# EAGLE design board (EAGLE 9.1.0)
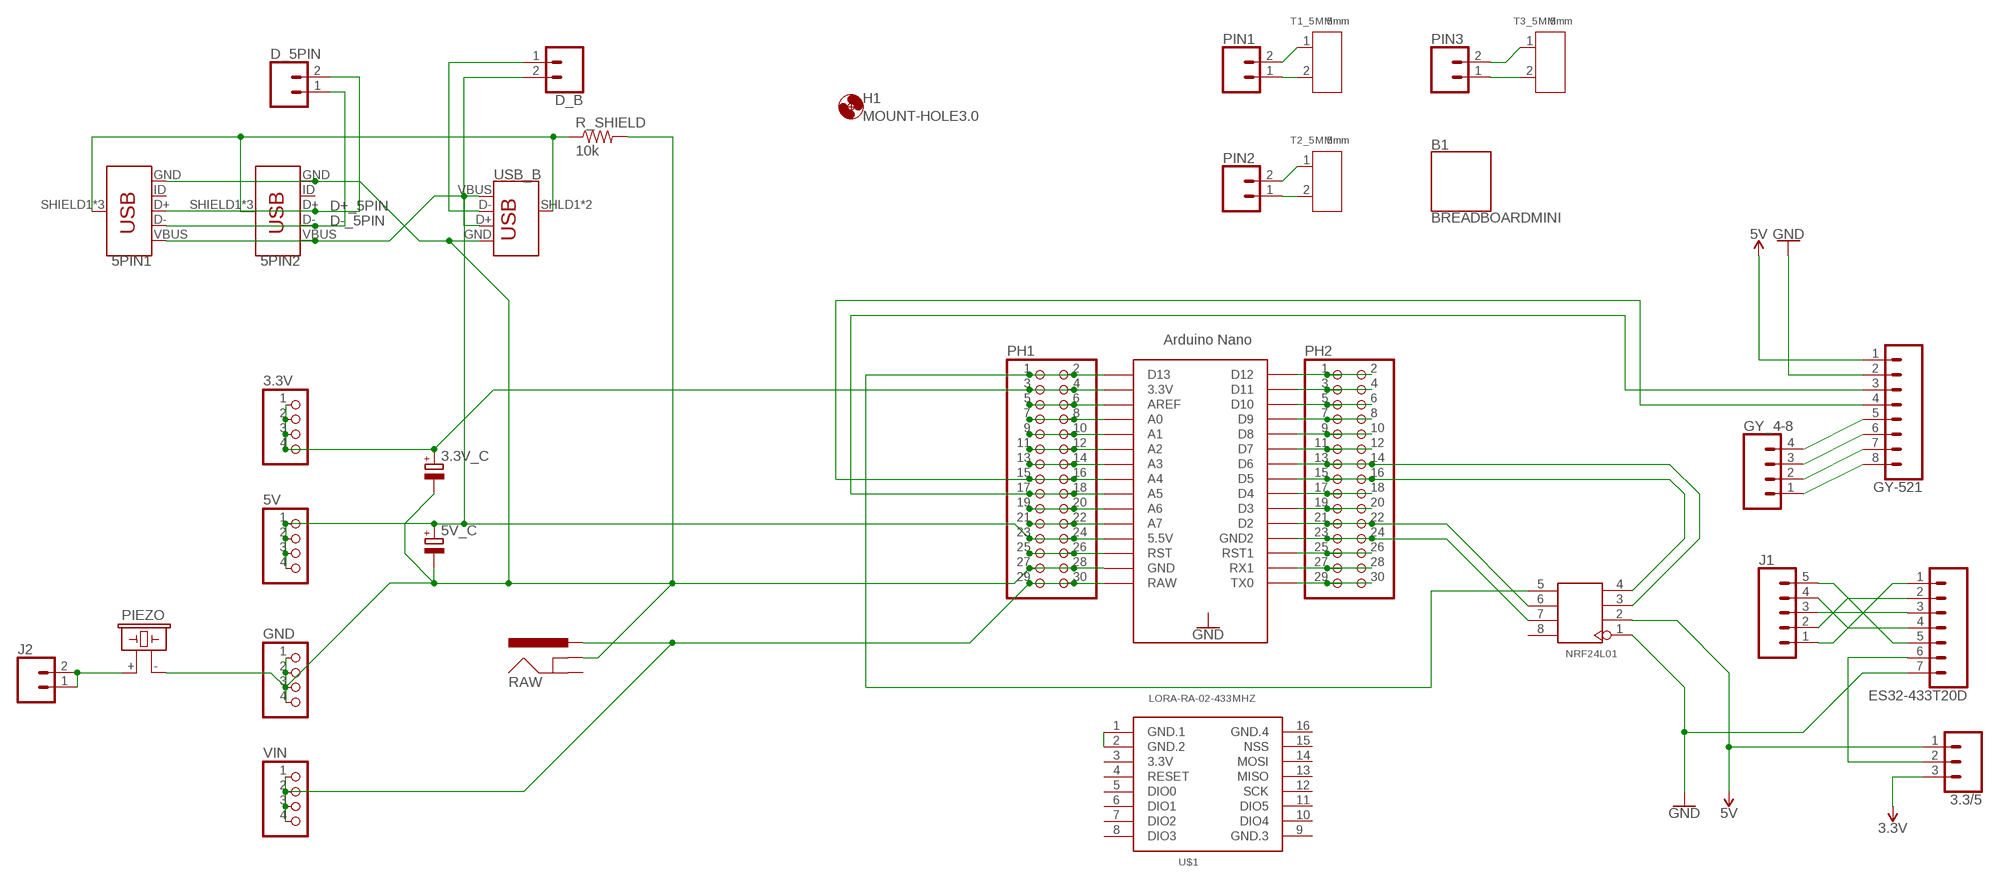
[diagram p0: schematic, sheet 1]

## Parts
3.3/5  CONN_03LOCK  [1X03_LOCK]
3.3V  PINHD-1X4  [1X04]
3.3V_C  CPOL-EUE2.5-5  [E2,5-5]
5PIN1  USB_MICRO-B_FEMALE-SMT  [USB-B-MICRO-SMD]
5PIN2  USB_MICRO-B_FEMALE-SMT  [USB-B-MICRO-SMD]
5V  PINHD-1X4  [1X04]
5V_C  CPOL-EUE3.5-8  [E3,5-8]
B1  BREADBOARDMINI  [BREADBOARD-MINI]
D_5PIN  CONN_02LOCK  [1X02_LOCK]
D_B  CONN_02LOCK  [1X02_LOCK]
ES32-433T20D  CONN_07LOCK  [1X07_LOCK]
GND  PINHD-1X4  [1X04]
GY-521  CONN_08LOCK  [1X08_LOCK]
GY_4-8  CONN_04LOCK  [1X04_LOCK]
H1  MOUNT-HOLE3.0  [3,0]
J1  CONN_05LOCK  [1X05_LOCK]
J2  CONN_02LOCK  [1X02_LOCK]
NANO  NANO  [NANO]
NRF24L01  DIP-BLACK-FEMALE-HEADER(2X4P-2.54)  [H2X4-2.54]
PH1  PINHD-2X15  [2X15]
PH2  PINHD-2X15  [2X15]
PIEZO  F/CM12P  [F/CM12P]
PIN1  CONN_02LOCK  [1X02_LOCK]
PIN2  CONN_02LOCK  [1X02_LOCK]
PIN3  CONN_02LOCK  [1X02_LOCK]
R_SHIELD  10k  R-US_0207/7  [0207/7]
RAW  POWER_JACKSLT  [POWER_JACK_SLOT]
T1_5MM  5mm  SCREW-TERMINAL-GREEN(2P-5.0)  [H2-5.0-10.5X8.0MM]
T2_5MM  5mm  SCREW-TERMINAL-GREEN(2P-5.0)  [H2-5.0-10.5X8.0MM]
T3_5MM  5mm  SCREW-TERMINAL-GREEN(2P-5.0)  [H2-5.0-10.5X8.0MM]
U$1  LORA-RA-02-433MHZ  [LORA-RA2-SMD]
USB_B  USB_B_PTH  [USB-B-PTH]
VIN  PINHD-1X4  [1X04]

## Nets
3.3V [power]: 3.3/5.3 3.3V.1 3.3V.2 3.3V.3 3.3V.4 3.3V_C.+ NANO.3.3V PH1.3 PH1.4
5V [power]: 3.3/5.1 5PIN1.VBUS 5PIN2.VBUS 5V.1 5V.2 5V.3 5V.4 5V_C.+ GY-521.1 NANO.5V(5.5V) NRF24L01.2 PH1.23 PH1.24 USB_B.VBUS
A5: GY-521.3 NANO.A5 PH1.17 PH1.18
A6: NANO.A6 PH1.19 PH1.20
A7: NANO.A7 PH1.21 PH1.22
CE_NRF: NANO.D6 NRF24L01.3 PH2.13 PH2.14
CSN_NRF: NANO.D5 NRF24L01.4 PH2.15 PH2.16
D+_5PIN: 5PIN1.D+ 5PIN2.D+ D_5PIN.2
D-_5PIN: 5PIN1.D- 5PIN2.D- D_5PIN.1
GND [power]: 3.3V_C.- 5PIN1.GND 5PIN2.GND 5V_C.- ES32-433T20D.7 GND.1 GND.2 GND.3 GND.4 GY-521.2 NANO.GND NANO.ICSP6 NRF24L01.1 PH1.27 PH1.28 PIEZO.- R_SHIELD.2 RAW.GND@1(GNDBREAK) USB_B.GND
MISO_NRF: NANO.GND1(GND2) NRF24L01.7 PH2.23 PH2.24
MOSI_NRF: NANO.D2 NRF24L01.6 PH2.21 PH2.22
N$1: U$1.1(GND.1) U$1.2(GND.2)
N$2: GY-521.5 GY_4-8.4
N$3: NANO.AREF PH1.5 PH1.6
N$4: NANO.A0 PH1.7 PH1.8
N$5: NANO.A1 PH1.9 PH1.10
N$6: NANO.A2 PH1.11 PH1.12
N$7: NANO.A3 PH1.13 PH1.14
N$8: GY-521.6 GY_4-8.3
N$9: GY-521.7 GY_4-8.2
N$10: GY-521.8 GY_4-8.1
N$11: 3.3/5.2 ES32-433T20D.6
N$12: ES32-433T20D.1 J1.1
N$13: ES32-433T20D.4 J1.4
N$14: ES32-433T20D.3 J1.3
N$15: ES32-433T20D.2 J1.2
N$16: NANO.D12 PH2.1 PH2.2
N$17: NANO.D11 PH2.3 PH2.4
N$18: NANO.D10 PH2.5 PH2.6
N$19: NANO.D9 PH2.7 PH2.8
N$20: NANO.D8 PH2.9 PH2.10
N$21: NANO.D7 PH2.11 PH2.12
N$22: ES32-433T20D.5 J1.5
N$23 [terminal]: PIN1.2 T1_5MM.1
N$24: NANO.D4 PH2.17 PH2.18
N$25: NANO.D3 PH2.19 PH2.20
N$26 [terminal]: PIN1.1 T1_5MM.2
N$27 [terminal]: PIN2.2 T2_5MM.1
N$28: NANO.RST1 PH2.25 PH2.26
N$29: NANO.RX1 PH2.27 PH2.28
N$30: NANO.TX0 PH2.29 PH2.30
N$31 [terminal]: PIN2.1 T2_5MM.2
N$32 [terminal]: PIN3.2 T3_5MM.1
N$33 [terminal]: PIN3.1 T3_5MM.2
N$34: J2.1 J2.2 PIEZO.+
N$35: D_B.1 USB_B.D-
N$36: D_B.2 USB_B.D+
RST: NANO.RST PH1.25 PH1.26
SCK_NRF: NANO.D13 NRF24L01.5 PH1.1 PH1.2
SDA_GY521: GY-521.4 NANO.A4 PH1.15 PH1.16
SHIELD_IN [power]: 5PIN1.SHIELD1(SHIELD) 5PIN1.SHIELD2(SHIELD) 5PIN1.SHIELD3(SHIELD) 5PIN2.SHIELD1(SHIELD) 5PIN2.SHIELD2(SHIELD) 5PIN2.SHIELD3(SHIELD) R_SHIELD.1 USB_B.SHLD1(SHIELD) USB_B.SHLD2(SHIELD)
VIN [power]: NANO.RAW PH1.29 PH1.30 RAW.PWR VIN.1 VIN.2 VIN.3 VIN.4
Unconnected: 5PIN1.ID 5PIN2.ID NANO.ICSP1 NANO.ICSP2 NANO.ICSP3 NANO.ICSP4 NANO.ICSP5 NRF24L01.8 RAW.GND@2(GND) U$1.4(RESET) U$1.5(DIO0) U$1.6(DIO1) U$1.7(DIO2) U$1.8(DIO3) U$1.10(DIO4) U$1.11(DIO5) U$1.12(SCK) U$1.13(MISO) U$1.14(MOSI) U$1.15(NSS)

## Power pins joined to a net without a drawn wire
3.3V: U$1.3(3.3V)
GND.3: U$1.9(GND.3)
GND.4: U$1.16(GND.4)

## Library data of the parts
3.3/5 = SparkFun-Connectors:CONN_03: Multi connection point. Often used as Generic Header-pin footprint for 0.1 inch spaced/style header connections On any of the 0.1 inch spaced packages, you can populate with these: Break Away Headers - Straight <https://www.sparkfun.com/products/116> (PRT-00116) Break Away Male Headers - Right Angle <https://www.sparkfun.com/products/553> (PRT-00553) Female Headers <https://www.sparkfun.com/products/115> (PRT-00115) Break Away Headers - Machine Pin <https://www.sparkfun.com/products/117> (PRT-00117) Break Away Female Headers - Swiss Machine Pin <https://www.sparkfun.com/products/743> (PRT-00743) Stackable Header - 3 Pin (Female, 0.1") <https://www.sparkfun.com/products/13875> (PRT-13875) For SCREWTERMINALS and SPRING TERMINALS visit here: Screw Terimnals on SparkFun.com <https://www.sparkfun.com/search/results?term=Screw+Terminals> (5mm/3.5mm/2.54mm spacing) This device is also useful as a general connection point to wire up your design to another part of your project. Our various solder wires solder well into these plated through hole pads. Hook-Up Wire - Assortment (Stranded, 22 AWG) <https://www.sparkfun.com/products/11375> (PRT-11375) Hook-Up Wire - Assortment (Solid Core, 22 AWG) <https://www.sparkfun.com/products/11367> (PRT-11367) View the entire wire category on our website here <https://www.sparkfun.com/categories/141> Special notes: Molex polarized connector foot print use with SKU : PRT-08232 with associated crimp pins and housings.
3.3V 5V GND VIN = pinhead:PINHD-1X4: PIN HEADER
3.3V_C = rcl:CPOL-EU: POLARIZED CAPACITOR, European symbol; SPICEPREFIX: C
5PIN1 5PIN2 = SparkFun-Connectors:USB_MICRO-B: USB Type Micro-B Connector Male/female and PTH/SMT variants SparkFun Products: SparkFun microB USB Breakout <https://www.sparkfun.com/products/12035> SparkFun USB microB Plug Breakout <https://www.sparkfun.com/products/10031> SparkFun ESP8266 Thing <https://www.sparkfun.com/products/13231>; PROD_ID: CONN-11752
5V_C = resistor:CPOL-EU: POLARIZED CAPACITOR, European symbol
B1 = SparkFun-Boards:BREADBOARD: SparkFun Breadboard Mini This is the mechnical outline for the very small self adhesive breadboard from SparkFun Electronics and our prototyping breadboard of the same size. Good for very small proto areas. SparkFun Products: White <https://www.sparkfun.com/products/7916> Green <https://www.sparkfun.com/products/12046> Black <https://www.sparkfun.com/products/12047> Red <https://www.sparkfun.com/products/12044> Blue <https://www.sparkfun.com/products/12045> SparkFun Solder-able Breadboard-Mini <https://www.sparkfun.com/products/12702>; PROD_ID: COMP-12034
D_5PIN D_B J2 PIN1-PIN3 = SparkFun-Connectors:CONN_02: Multi connection point. Often used as Generic Header-pin footprint for 0.1 inch spaced/style header connections On any of the 0.1 inch spaced packages, you can populate with these: Break Away Headers - Straight <https://www.sparkfun.com/products/116> (PRT-00116) Break Away Male Headers - Right Angle <https://www.sparkfun.com/products/553> (PRT-00553) Female Headers <https://www.sparkfun.com/products/115> (PRT-00115) Break Away Headers - Machine Pin <https://www.sparkfun.com/products/117> (PRT-00117) Break Away Female Headers - Swiss Machine Pin <https://www.sparkfun.com/products/743> (PRT-00743) For SCREWTERMINALS and SPRING TERMINALS visit here: Screw Terimnals on SparkFun.com <https://www.sparkfun.com/search/results?term=Screw+Terminals> (5mm/3.5mm/2.54mm spacing) This device is also useful as a general connection point to wire up your design to another part of your project. Our various solder wires solder well into these plated through hole pads. Hook-Up Wire - Assortment (Stranded, 22 AWG) <https://www.sparkfun.com/products/11375> (PRT-11375) Hook-Up Wire - Assortment (Solid Core, 22 AWG) <https://www.sparkfun.com/products/11367> (PRT-11367) View the entire wire category on our website here <https://www.sparkfun.com/categories/141> Special notes: Molex polarized connector foot print use with: PRT-08233 with associated crimp pins and housings. 2.54_SCREWTERM for use with PRT-10571. 3.5mm Screw Terminal footprints for PRT-08084 5mm Screw Terminal footprints for use with PRT-08432
ES32-433T20D = SparkFun-Connectors:CONN_07: Multi connection point. Often used as Generic Header-pin footprint for 0.1 inch spaced/style header connections On any of the 0.1 inch spaced packages, you can populate with these: Break Away Headers - Straight <https://www.sparkfun.com/products/116> (PRT-00116) Break Away Male Headers - Right Angle <https://www.sparkfun.com/products/553> (PRT-00553) Female Headers <https://www.sparkfun.com/products/115> (PRT-00115) Break Away Headers - Machine Pin <https://www.sparkfun.com/products/117> (PRT-00117) Break Away Female Headers - Swiss Machine Pin <https://www.sparkfun.com/products/743> (PRT-00743) For SCREWTERMINALS and SPRING TERMINALS visit here: Screw Terimnals on SparkFun.com <https://www.sparkfun.com/search/results?term=Screw+Terminals> (5mm/3.5mm/2.54mm spacing) This device is also useful as a general connection point to wire up your design to another part of your project. Our various solder wires solder well into these plated through hole pads. Hook-Up Wire - Assortment (Stranded, 22 AWG) <https://www.sparkfun.com/products/11375> (PRT-11375) Hook-Up Wire - Assortment (Solid Core, 22 AWG) <https://www.sparkfun.com/products/11367> (PRT-11367) View the entire wire category on our website here <https://www.sparkfun.com/categories/141> Special notes: Molex polarized connector foot print use with SKU : PRT-08231 with associated crimp pins and housings. 1MM SMD Version SKU: PRT-10208 NOTES ON THE VARIANTS LOCK and LOCK_LONGPADS... This footprint was designed to help hold the alignment of a through-hole component (i.e. 6-pin header) while soldering it into place. You may notice that each hole has been shifted either up or down by 0.005 of an inch from it's more standard position (which is a perfectly straight line). This slight alteration caused the pins (the squares in the middle) to touch the edges of the holes. Because they are alternating, it causes a "brace" to hold the component in place. 0.005 has proven to be the perfect amount of "off-center" position when using our standard breakaway headers. Although looks a little odd when you look at the bare footprint, once you have a header in there, the alteration is very hard to notice. Also,if you push a header all the way into place, it is covered up entirely on the bottom side.
GY-521 = SparkFun-Connectors:CONN_08: Multi connection point. Often used as Generic Header-pin footprint for 0.1 inch spaced/style header connections On any of the 0.1 inch spaced packages, you can populate with these: Break Away Headers - Straight <https://www.sparkfun.com/products/116> (PRT-00116) Break Away Male Headers - Right Angle <https://www.sparkfun.com/products/553> (PRT-00553) Female Headers <https://www.sparkfun.com/products/115> (PRT-00115) Break Away Headers - Machine Pin <https://www.sparkfun.com/products/117> (PRT-00117) Break Away Female Headers - Swiss Machine Pin <https://www.sparkfun.com/products/743> (PRT-00743) Arduino Stackable Header - 8 Pin <https://www.sparkfun.com/products/9279> (PRT-09279) For SCREWTERMINALS and SPRING TERMINALS visit here: Screw Terimnals on SparkFun.com <https://www.sparkfun.com/search/results?term=Screw+Terminals> (5mm/3.5mm/2.54mm spacing) This device is also useful as a general connection point to wire up your design to another part of your project. Our various solder wires solder well into these plated through hole pads. Hook-Up Wire - Assortment (Stranded, 22 AWG) <https://www.sparkfun.com/products/11375> (PRT-11375) Hook-Up Wire - Assortment (Solid Core, 22 AWG) <https://www.sparkfun.com/products/11367> (PRT-11367) View the entire wire category on our website here <https://www.sparkfun.com/categories/141> Special notes: Molex polarized connector foot print use with SKU : PRT-08231 with associated crimp pins and housings. 1MM SMD Version SKU: PRT-10208 NOTES ON THE VARIANTS LOCK and LOCK_LONGPADS... This footprint was designed to help hold the alignment of a through-hole component (i.e. 6-pin header) while soldering it into place. You may notice that each hole has been shifted either up or down by 0.005 of an inch from it's more standard position (which is a perfectly straight line). This slight alteration caused the pins (the squares in the middle) to touch the edges of the holes. Because they are alternating, it causes a "brace" to hold the component in place. 0.005 has proven to be the perfect amount of "off-center" position when using our standard breakaway headers. Although looks a little odd when you look at the bare footprint, once you have a header in there, the alteration is very hard to notice. Also,if you push a header all the way into place, it is covered up entirely on the bottom side.
GY_4-8 = SparkFun-Connectors:CONN_04: Multi connection point. Often used as Generic Header-pin footprint for 0.1 inch spaced/style header connections On any of the 0.1 inch spaced packages, you can populate with these: Break Away Headers - Straight <https://www.sparkfun.com/products/116> (PRT-00116) Break Away Male Headers - Right Angle <https://www.sparkfun.com/products/553> (PRT-00553) Female Headers <https://www.sparkfun.com/products/115> (PRT-00115) Break Away Headers - Machine Pin <https://www.sparkfun.com/products/117> (PRT-00117) Break Away Female Headers - Swiss Machine Pin <https://www.sparkfun.com/products/743> (PRT-00743) For SCREWTERMINALS and SPRING TERMINALS visit here: Screw Terimnals on SparkFun.com <https://www.sparkfun.com/search/results?term=Screw+Terminals> (5mm/3.5mm/2.54mm spacing) This device is also useful as a general connection point to wire up your design to another part of your project. Our various solder wires solder well into these plated through hole pads. Hook-Up Wire - Assortment (Stranded, 22 AWG) <https://www.sparkfun.com/products/11375> (PRT-11375) Hook-Up Wire - Assortment (Solid Core, 22 AWG) <https://www.sparkfun.com/products/11367> (PRT-11367) View the entire wire category on our website here <https://www.sparkfun.com/categories/141> Special notes: Molex polarized connector foot print use with SKU : PRT-08231 with associated crimp pins and housings. 1MM SMD Version SKU: PRT-10208; PROD_ID: CONN-09696
H1 = holes:MOUNT-HOLE: MOUNTING HOLE with drill center marker
J1 = SparkFun-Connectors:CONN_05: Multi connection point. Often used as Generic Header-pin footprint for 0.1 inch spaced/style header connections On any of the 0.1 inch spaced packages, you can populate with these: Break Away Headers - Straight <https://www.sparkfun.com/products/116> (PRT-00116) Break Away Male Headers - Right Angle <https://www.sparkfun.com/products/553> (PRT-00553) Female Headers <https://www.sparkfun.com/products/115> (PRT-00115) Break Away Headers - Machine Pin <https://www.sparkfun.com/products/117> (PRT-00117) Break Away Female Headers - Swiss Machine Pin <https://www.sparkfun.com/products/743> (PRT-00743) For SCREWTERMINALS and SPRING TERMINALS visit here: Screw Terimnals on SparkFun.com <https://www.sparkfun.com/search/results?term=Screw+Terminals> (5mm/3.5mm/2.54mm spacing) This device is also useful as a general connection point to wire up your design to another part of your project. Our various solder wires solder well into these plated through hole pads. Hook-Up Wire - Assortment (Stranded, 22 AWG) <https://www.sparkfun.com/products/11375> (PRT-11375) Hook-Up Wire - Assortment (Solid Core, 22 AWG) <https://www.sparkfun.com/products/11367> (PRT-11367) View the entire wire category on our website here <https://www.sparkfun.com/categories/141> Special notes: Molex polarized connector foot print use with SKU : PRT-08231 with associated crimp pins and housings. 1MM SMD Version SKU: PRT-10208
NANO = Arduino-clone:NANO: Arduino Nano
NRF24L01 = Seeed-Connector:DIP-BLACK-FEMALE-HEADER(2X4P-2.54): 320030087; VALUE: 2X4P-2.54
PH1 PH2 = pinhead:PINHD-2X15: PIN HEADER
PIEZO = buzzer:F/CM12P: BUZZER Source: Buerklin; OC_FARNELL: unknown; OC_NEWARK: unknown
R_SHIELD = rcl:R-US_: RESISTOR, American symbol; SPICEPREFIX: R
RAW = SparkFun-Connectors:POWER_JACK: Power Jack Connector This is the standard 5.5mm barrel jack for power. The PTH is the most common, proven, reliable, footprint. The Slot footprint only works if the mill layer is transmitted to the PCB fab house so be warned. Here are the connectors we sell at SparkFun: DC Barrel Power Jack/Connector <https://www.sparkfun.com/products/119> (PRT-00119) DC Barrel Power Jack/Connector (SMD) <https://www.sparkfun.com/products/12748> (PRT-12748) DC Barrel Jack Adapter - Breadboard Compatible <https://www.sparkfun.com/products/10811> (PRT-10811) It is used on this SparkFun product (and many, many others): SparkFun RedBoard - Programmed with Arduino <https://www.sparkfun.com/products/12757> (DEV-12757) Also, if you need a mating power supply or connector, please check these out: Wall Adapter Power Supply - 9VDC 650mA <https://www.sparkfun.com/products/298> (TOL-00298) DC Barrel Jack Adapter - Male <https://www.sparkfun.com/products/10287> (PRT-10287); PROD_ID: PRT-00119
T1_5MM T2_5MM T3_5MM = Seeed-Connector:SCREW-TERMINAL-GREEN(2P-5.0): 320110031; VALUE: GREEN-2P-5.0
U$1 = LikeCircuit:LORA-RA-02-433MHZ: 433 MHz Lora Ra-02 Radio Transceiver Module based on SX1276 chip. Visit our more eagle PCB <https://www.likecircuit.com/>
USB_B = SparkFun-Connectors:USB_B: USB Type B Connector SparkFun Products: SparkFun Stepoko <https://www.sparkfun.com/products/13899> PTH; PROD_ID: CONN-08278; SF_ID: PRT-00139

## Net classes
0 default: width 0.127 mm, drill 0.127 mm, clearance 0.127 mm
1 power: width 0.762 mm, clearance 0.305 mm
2 terminal: width 2.54 mm, clearance 0.305 mm

## Board
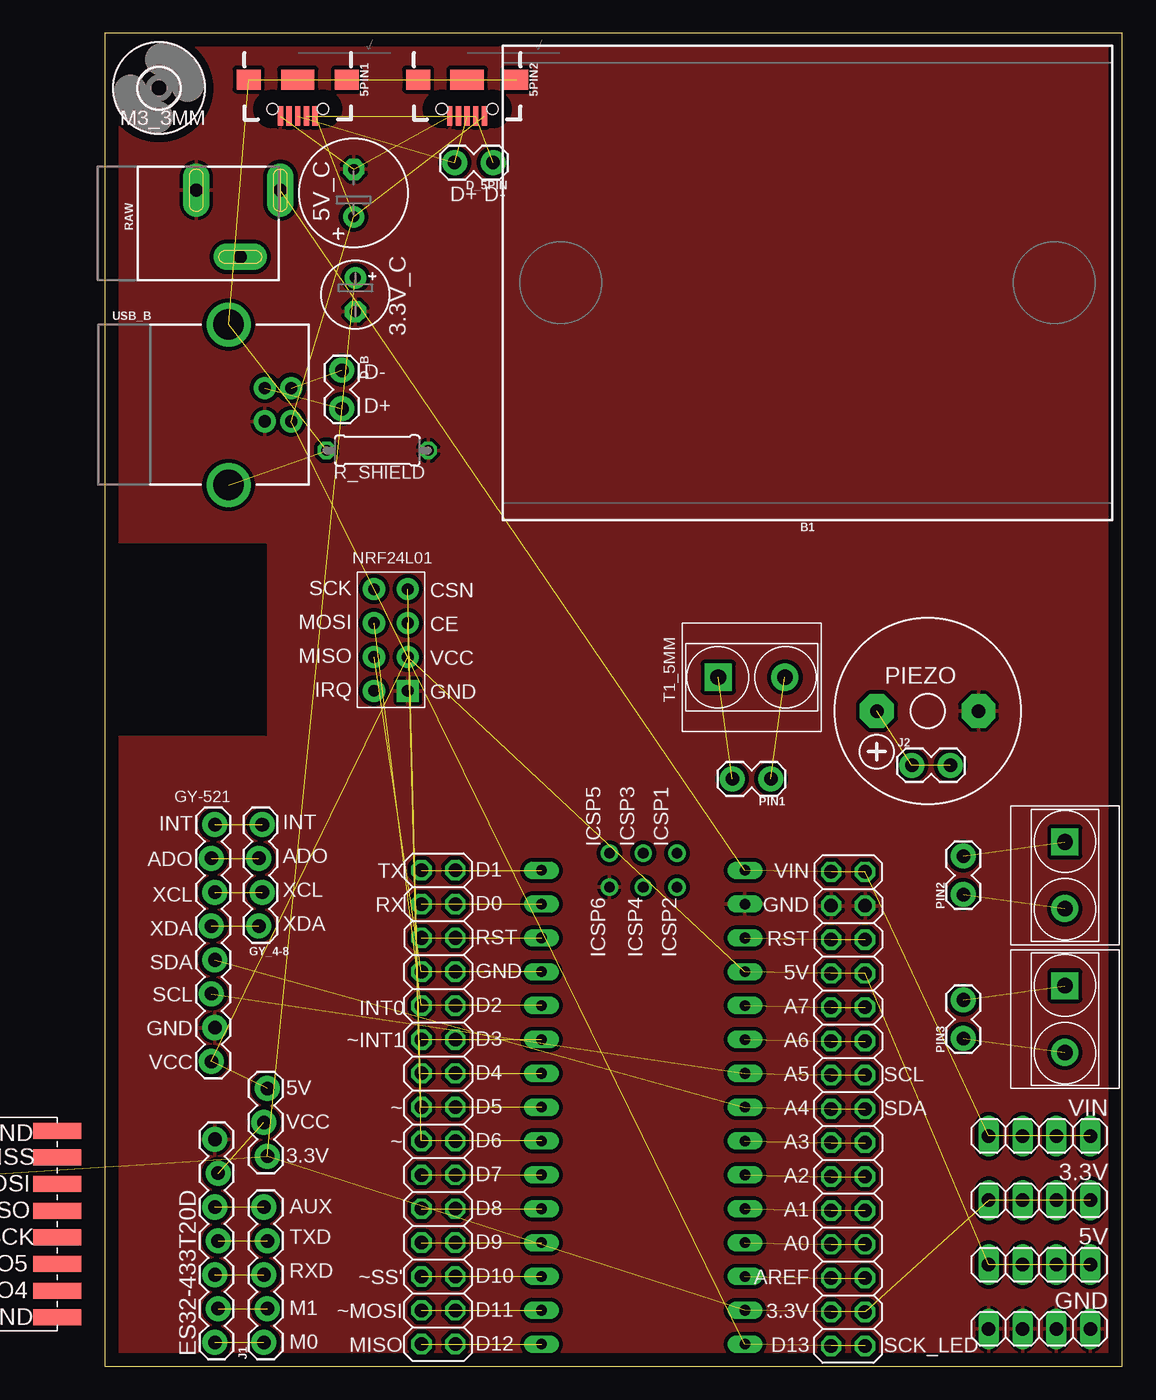
[diagram p1: board, top side]
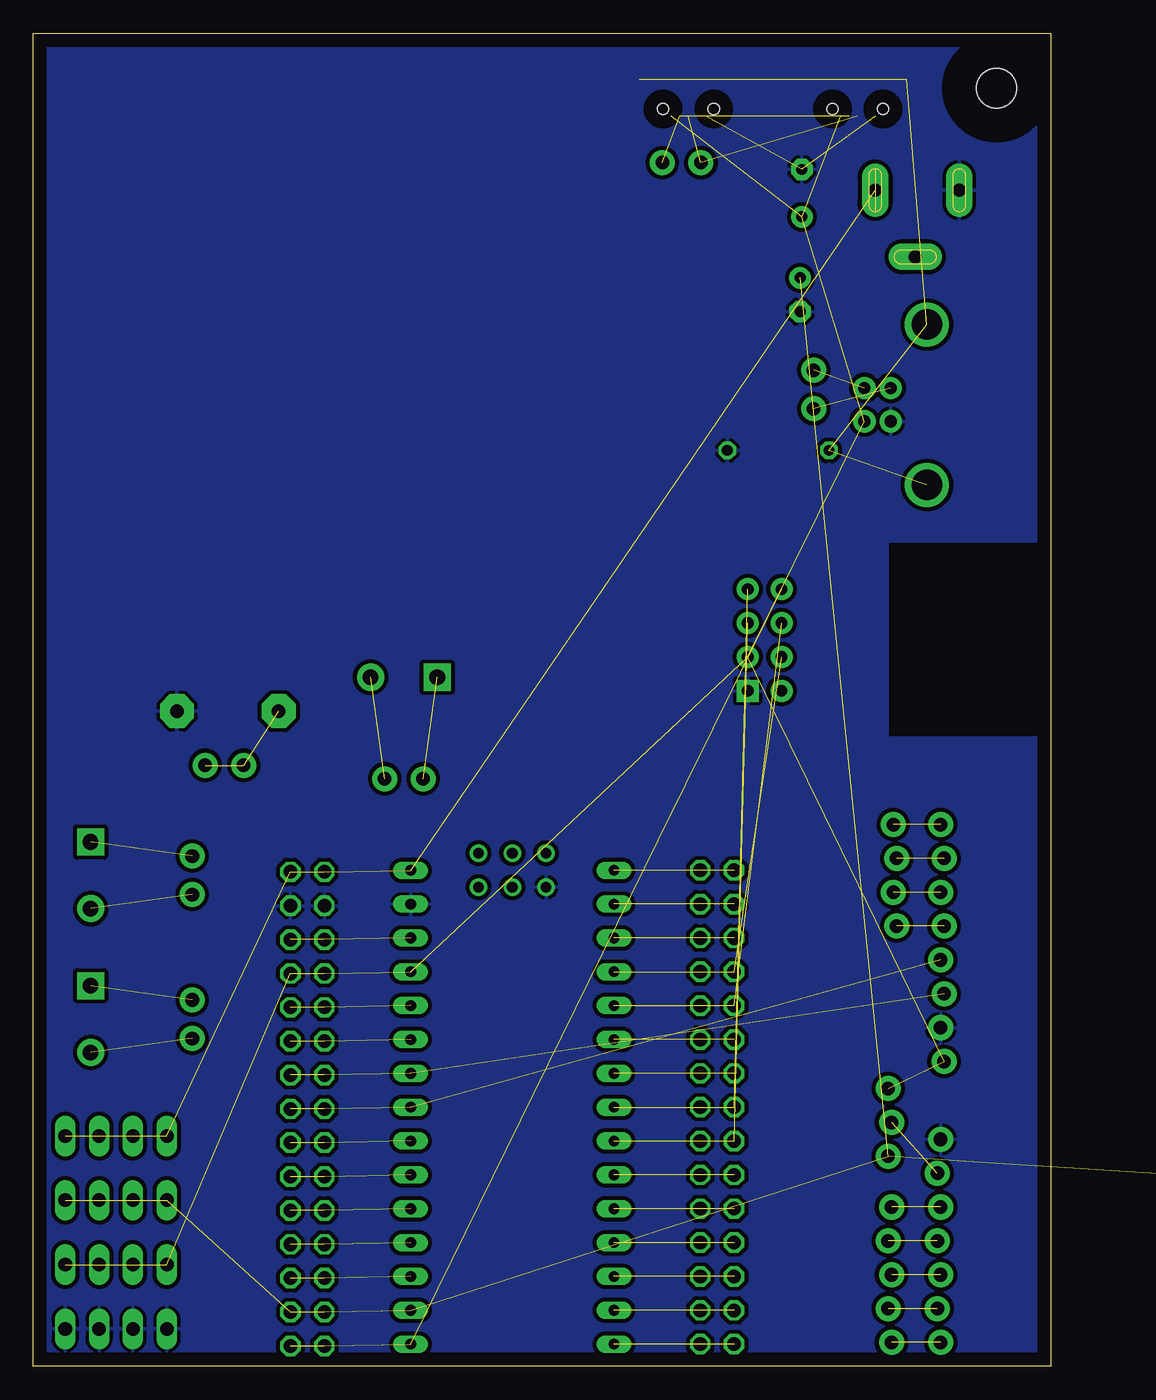
[diagram p2: board, bottom side, seen from below]

Size 76.31 x 100 mm. Coordinates in mm from the lower left corner, seen from the top.
Outline: 0,0 76.31,0 76.31,100 0,100 0,0
Copper layers (1*16): Top 0.035mm / dielectric 1.5mm / Bottom 0.035mm
Design rules "default": minimum track width 6mil, minimum drill 0.35mm, track to track 6mil, track to pad 6mil, pad to pad 6mil, via to via 6mil, smd to smd 6mil, copper to edge 40mil, drill to drill 6mil, minimum pad ring 10mil, minimum via ring 8mil, stop-mask expansion 4mil, vias tented up to drill 0mil, thermal gap 10mil
tRestrict: area 0.5,47.3 to 12.1,61.7
bRestrict: area 0.5,47.3 to 12.1,61.7

### Footprints (pad centres in the part's own frame; a part is rotated, then mirrored left to right if it is on the bottom)
1X03_LOCK = drill 1.016 pad 1.88: 1 0,0.127; 2 2.54,-0.127; 3 5.08,0.127
1X04 = drill 1.016 long: 1 -3.81,0; 2 -1.27,0; 3 1.27,0; 4 3.81,0
E2,5-5 = drill 0.813 pad 1.6: + -1.27,0 | drill 0.813 pad 1.6 octagon: - 1.27,0
USB-B-MICRO-SMD = smd 1.45 x 0.4: D+ 2.725,0; D- 2.725,0.65; GND 2.725,-1.3; ID 2.725,-0.65; VBUS 2.725,1.3 | smd 1.5 x 1.8: SHIELD1 0,3.685; SHIELD2 0,-3.685 | smd 1.5 x 2.5: SHIELD3 0,0 | hole 0.85: 2.2,1.9; 2.2,-1.9
E3,5-8 = drill 0.813 pad 1.6: + -1.778,0 | drill 0.813 pad 1.6 octagon: - 1.778,0
1X02_LOCK = drill 1.016 pad 1.88: 1 -0.178,0; 2 2.718,0
1X07_LOCK = drill 1.016 pad 1.88: 1 0,0.127; 2 2.54,-0.127; 3 5.08,0.127; 4 7.62,-0.127; 5 10.16,0.127; 6 12.7,-0.127; 7 15.24,0.127
1X08_LOCK = drill 1.016 pad 1.88: 1 0,0.127; 2 2.54,-0.127; 3 5.08,0.127; 4 7.62,-0.127; 5 10.16,0.127; 6 12.7,-0.127; 7 15.24,0.127; 8 17.78,-0.127
1X04_LOCK = drill 1.016 pad 1.88: 1 0,0.127; 2 2.54,-0.127; 3 5.08,0.127; 4 7.62,-0.127
3,0 = hole 3: 0,0
1X05_LOCK = drill 1.016 pad 1.88: 1 0,0.127; 2 2.54,-0.127; 3 5.08,0.127; 4 7.62,-0.127; 5 10.16,0.127
NANO = drill 0.8 long: 3.3V -10.16,24.13; 5V -10.16,-1.27; A0 -10.16,19.05; A1 -10.16,16.51; A2 -10.16,13.97; A3 -10.16,11.43; A4 -10.16,8.89; A5 -10.16,6.35; A6 -10.16,3.81; A7 -10.16,1.27; AREF -10.16,21.59; D2 5.08,1.27; D3 5.08,3.81; D4 5.08,6.35; D5 5.08,8.89; D6 5.08,11.43; D7 5.08,13.97; D8 5.08,16.51; D9 5.08,19.05; D10 5.08,21.59; D11 5.08,24.13; D12 5.08,26.67; D13 -10.16,26.67; GND -10.16,-6.35; GND1 5.08,-1.27; RAW -10.16,-8.89; RST -10.16,-3.81; RST1 5.08,-3.81; RX1 5.08,-6.35; TX0 5.08,-8.89 | drill 0.8: ICSP1 -5.08,-10.16; ICSP2 -5.08,-7.62; ICSP3 -2.54,-10.16; ICSP4 -2.54,-7.62; ICSP5 0,-10.16; ICSP6 0,-7.62
H2X4-2.54 = drill 0.889 pad 1.651 square: 1 -1.27,3.81 | drill 0.889 pad 1.651: 2 -1.27,1.27; 3 -1.27,-1.27; 4 -1.27,-3.81; 5 1.27,-3.81; 6 1.27,-1.27; 7 1.27,1.27; 8 1.27,3.81
2X15 = drill 1.016 octagon: 1 -17.78,-1.27; 2 -17.78,1.27; 3 -15.24,-1.27; 4 -15.24,1.27; 5 -12.7,-1.27; 6 -12.7,1.27; 7 -10.16,-1.27; 8 -10.16,1.27; 9 -7.62,-1.27; 10 -7.62,1.27; 11 -5.08,-1.27; 12 -5.08,1.27; 13 -2.54,-1.27; 14 -2.54,1.27; 15 0,-1.27; 16 0,1.27; 17 2.54,-1.27; 18 2.54,1.27; 19 5.08,-1.27; 20 5.08,1.27; 21 7.62,-1.27; 22 7.62,1.27; 23 10.16,-1.27; 24 10.16,1.27; 25 12.7,-1.27; 26 12.7,1.27; 27 15.24,-1.27; 28 15.24,1.27; 29 17.78,-1.27; 30 17.78,1.27
F/CM12P = drill 1.016 pad 2.54 octagon: + 3.81,0; - -3.81,0
0207/7 = drill 0.813 octagon: 1 -3.81,0; 2 3.81,0
POWER_JACK_SLOT = drill 1 pad 2 long: GND@1 2.58,7.5; GND@2 7.58,10.8; PWR 2.58,13.8
H2-5.0-10.5X8.0MM = drill 1.168 pad 2.032 square: 1 0,2.5 | drill 1.168 pad 2.032: 2 0,-2.5
LORA-RA2-SMD = smd 3.6 x 1.2: 1 -8,7; 2 -8,5; 3 -8,3; 4 -8,1; 5 -8,-1; 6 -8,-3; 7 -8,-5; 8 -8,-7; 9 8,-7; 10 8,-5; 11 8,-3; 12 8,-1; 13 8,1; 14 8,3; 15 8,5; 16 8,7
USB-B-PTH = drill 0.914 pad 1.676: D+ 4,1.25; D- 5.981,1.25; GND 4,-1.25; VBUS 5.981,-1.25 | drill 2.286: SHLD1 1.282,-6.02; SHLD2 1.282,6.02

### Placement (x,y rotation side)
3.3/5  12.06,20.83 270 top
3.3V  70.1,12.45 180 top
3.3V_C  18.8,80.39 270 top
5PIN1  14.48,96.52 270 top
5PIN2  27.18,96.52 270 top
5V  70.1,7.62 180 top
5V_C  18.67,88.01 90 top
B1  52.7,81.28 180 top
D_5PIN  28.96,90.3 180 top
D_B  17.78,74.55 270 top
ES32-433T20D  8.38,1.78 90 top
GND  70.1,2.79 180 top
GY-521  8.13,22.86 90 top
GY_4-8  11.68,40.64 270 top
H1  4.06,95.89 0 top
J1  12.06,1.78 90 top
J2  60.71,45.09 0 top
NANO  37.85,28.32 180 top
NRF24L01  21.46,54.48 180 top
PH1  55.75,19.3 90 top
PH2  25.02,19.43 90 top
PIEZO  61.72,49.15 180 top
PIN1  49.78,44.07 180 top
PIN2  64.39,35.56 90 top
PIN3  64.39,24.77 90 top
R_SHIELD  20.45,68.71 0 top
RAW  -0.64,90.81 270 top
T1_5MM  48.51,51.69 90 top
T2_5MM  72.01,36.83 0 top
T3_5MM  72.01,26.04 0 top
U$1  -11.56,10.67 0 top  (outside the outline)
USB_B  8,72.14 0 top
VIN  70.1,17.27 180 top

### Tracks (layer width: path | path; a pad name or v marks a point on that pad's centre or on a via)
3.3V  (9 unrouted)
5V  (13 unrouted)
A5  (3 unrouted)
A6  (2 unrouted)
A7  (2 unrouted)
CE_NRF  (3 unrouted)
CSN_NRF  (3 unrouted)
D+_5PIN  (2 unrouted)
D-_5PIN  (2 unrouted)
GND  (2 unrouted)
  pour Top: 85.09,99.95 85.09,0 0,0 0,99.95
  pour Bottom: 0,0 85.09,0.13 85.09,99.95 0,99.82
MISO_NRF  (3 unrouted)
MOSI_NRF  (3 unrouted)
N$1  (1 unrouted)
N$2  (1 unrouted)
N$3  (2 unrouted)
N$4  (2 unrouted)
N$5  (2 unrouted)
N$6  (2 unrouted)
N$7  (2 unrouted)
N$8  (1 unrouted)
N$9  (1 unrouted)
N$10  (1 unrouted)
N$11  (1 unrouted)
N$12  (1 unrouted)
N$13  (1 unrouted)
N$14  (1 unrouted)
N$15  (1 unrouted)
N$16  (2 unrouted)
N$17  (2 unrouted)
N$18  (2 unrouted)
N$19  (2 unrouted)
N$20  (2 unrouted)
N$21  (2 unrouted)
N$22  (1 unrouted)
N$23  (1 unrouted)
N$24  (2 unrouted)
N$25  (2 unrouted)
N$26  (1 unrouted)
N$27  (1 unrouted)
N$28  (2 unrouted)
N$29  (2 unrouted)
N$30  (2 unrouted)
N$31  (1 unrouted)
N$32  (1 unrouted)
N$33  (1 unrouted)
N$34  (2 unrouted)
N$35  (1 unrouted)
N$36  (1 unrouted)
RST  (2 unrouted)
SCK_NRF  (3 unrouted)
SDA_GY521  (3 unrouted)
SHIELD_IN  (8 unrouted)
VIN  (7 unrouted)

### Text on the board
tPlace: M3_3MM | D+ | D- | D- | D+ | SCK | CSN | MOSI | CE | MISO | VCC | IRQ | GND | INT | INT | ADO | ICSP5 | ICSP3 | ICSP1 | ADO | TX | VIN | D1 | XCL | XCL | RX | ICSP6 | ICSP4 | ICSP2 | GND | D0 | XDA | XDA | RST | RST | SDA | 5V | GND | SCL | A7 | INT0 | D2 | GND | ~INT1 | A6 | D3 | VCC | A5 | D4 | SCL | 5V | ~ | A4 | D5 | SDA | VCC | ~ | A3 | D6 | 3.3V | A2 | D7 | A1 | AUX | D8 | A0 | TXD | D9 | RXD | ~SS' | AREF | D10 | ~MOSI | 3.3V | M1 | D11 | MISO | D13 | M0 | D12 | SCK_LED
silktop: TOP
silkbottom: BOT